# EAGLE schematic PT08M (EAGLE 6.6.0)

## Sheet 1 of 3
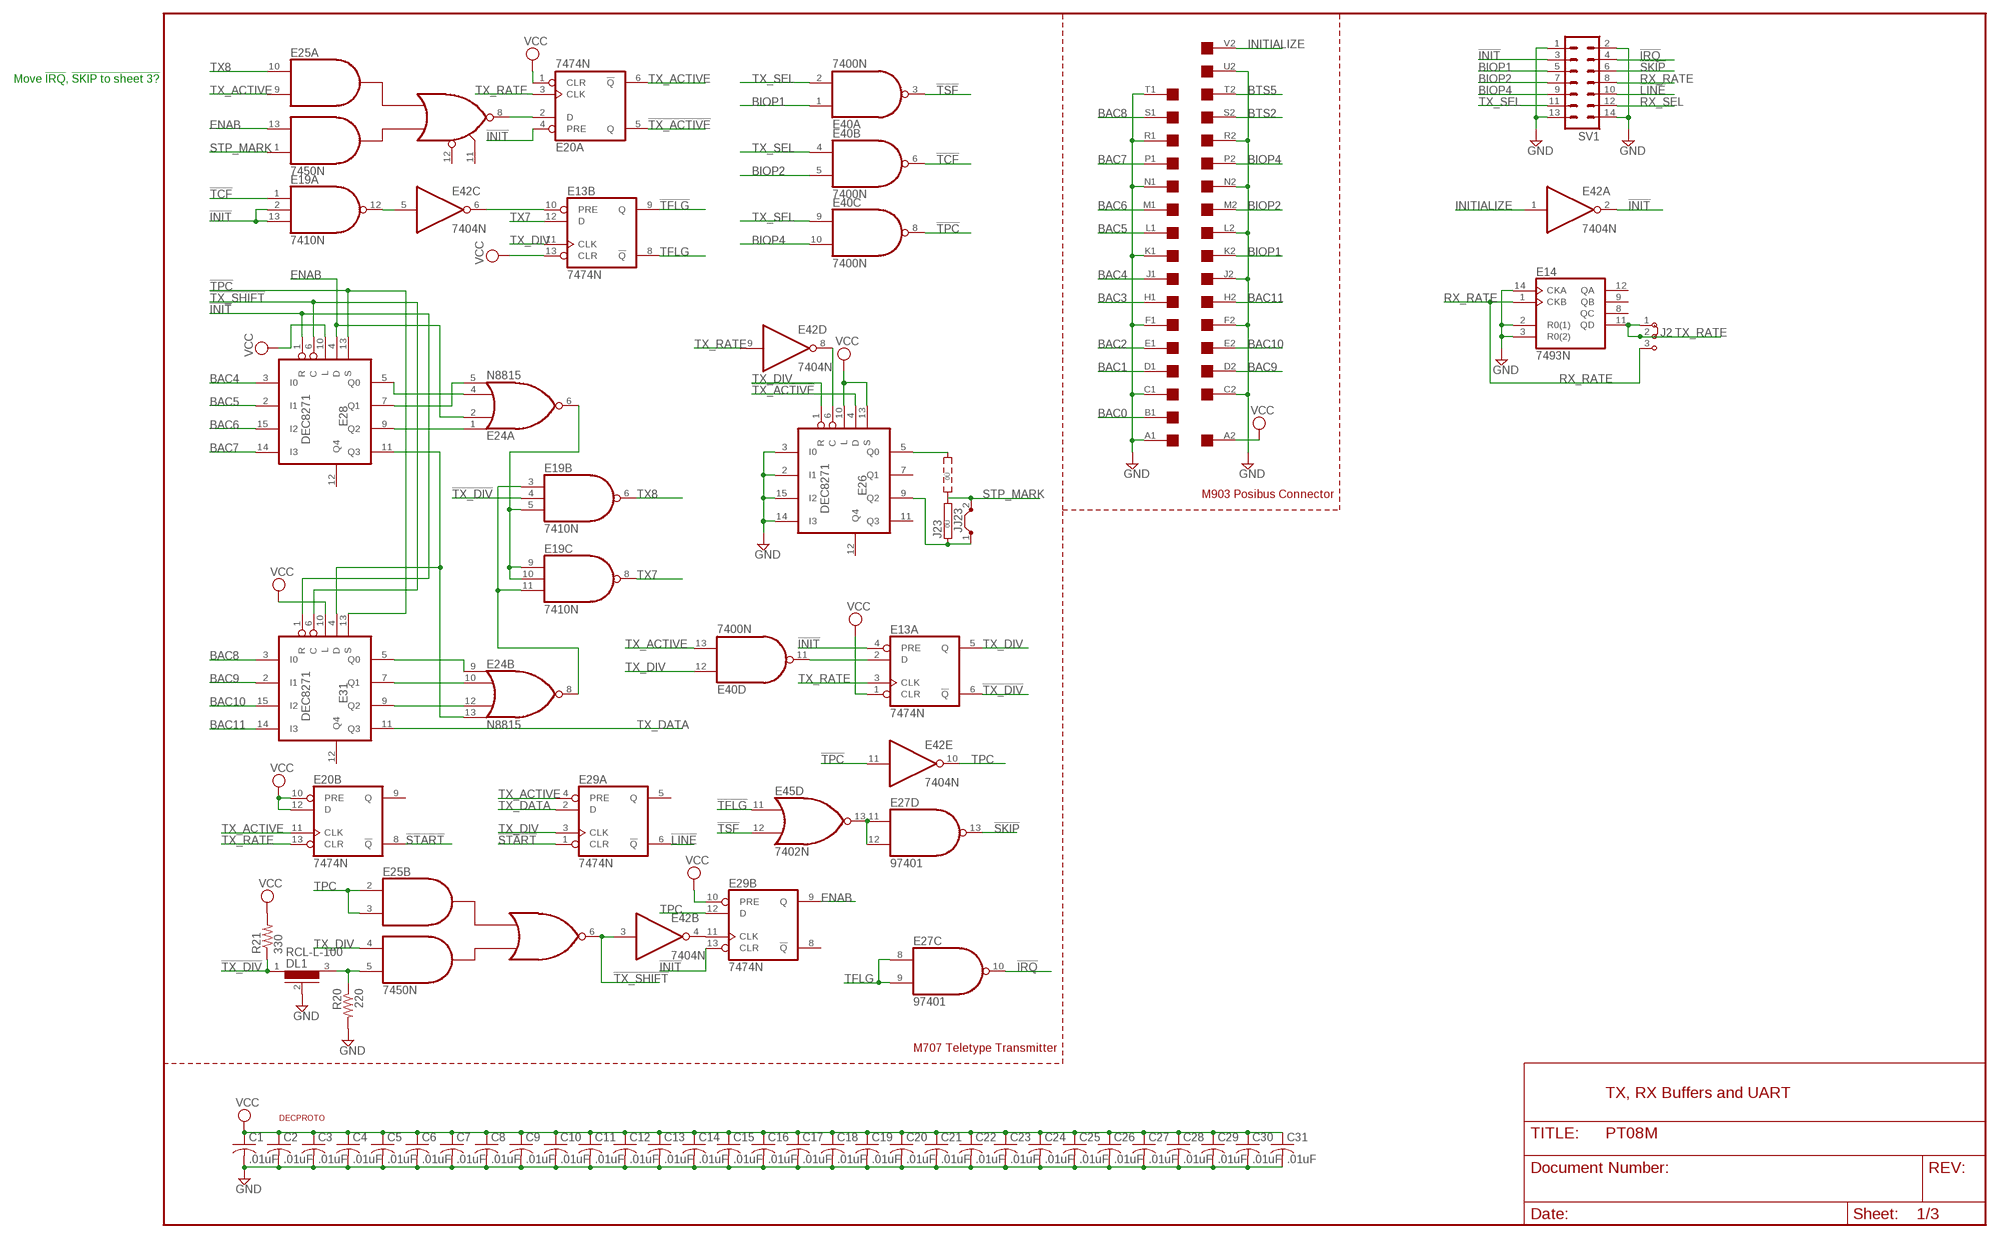
[diagram p0: schematic, sheet 1]

### Parts
C1  .01uF  C-US050-025X075  [C050-025X075]
C2  .01uF  C-US050-025X075  [C050-025X075]
C3  .01uF  C-US050-025X075  [C050-025X075]
C4  .01uF  C-US050-025X075  [C050-025X075]
C5  .01uF  C-US050-025X075  [C050-025X075]
C6  .01uF  C-US050-025X075  [C050-025X075]
C7  .01uF  C-US050-025X075  [C050-025X075]
C8  .01uF  C-US050-025X075  [C050-025X075]
C9  .01uF  C-US050-025X075  [C050-025X075]
C10  .01uF  C-US050-025X075  [C050-025X075]
C11  .01uF  C-US050-025X075  [C050-025X075]
C12  .01uF  C-US050-025X075  [C050-025X075]
C13  .01uF  C-US050-025X075  [C050-025X075]
C14  .01uF  C-US050-025X075  [C050-025X075]
C15  .01uF  C-US050-025X075  [C050-025X075]
C16  .01uF  C-US050-025X075  [C050-025X075]
C17  .01uF  C-US050-025X075  [C050-025X075]
C18  .01uF  C-US050-025X075  [C050-025X075]
C19  .01uF  C-US050-025X075  [C050-025X075]
C20  .01uF  C-US050-025X075  [C050-025X075]
C21  .01uF  C-US050-025X075  [C050-025X075]
C22  .01uF  C-US050-025X075  [C050-025X075]
C23  .01uF  C-US050-025X075  [C050-025X075]
C24  .01uF  C-US050-025X075  [C050-025X075]
C25  .01uF  C-US050-025X075  [C050-025X075]
C26  .01uF  C-US050-025X075  [C050-025X075]
C27  .01uF  C-US050-025X075  [C050-025X075]
C28  .01uF  C-US050-025X075  [C050-025X075]
C29  .01uF  C-US050-025X075  [C050-025X075]
C30  .01uF  C-US050-025X075  [C050-025X075]
C31  .01uF  C-US050-025X075  [C050-025X075]
DL1  RCL-L-100  RCL-L-00-05  [RCL-L-00-05]
E13  7474N  74S74N  [DIL14]
E14  7493N  74LS93N  [DIL14]
E19  7410N  [DIL14]
E20  7474N  74S74N  [DIL14]
E24  N8815  [DIL14]
E25  7450N  [DIL14]
E26  DEC8271  [DIL16]
E27  97401  74LS01N  [DIL14]
E28  DEC8271  [DIL16]
E29  7474N  74S74N  [DIL14]
E31  DEC8271  [DIL16]
E40  7400N  [DIL14]
E42  7404N  [DIL14]
E45  7402N  [DIL14]
J2  J2X2MM  [04C]
J23  0R2  [0R2/10]
JJ23  J10MM  [10]
N14  EDGE-2CONNECTOR  [EDGE-CON2]
R20  220  R-US_0207/10  [0207/10]
R21  330  R-US_0207/10  [0207/10]
SV1  ML14L  [ML14L]
U$2  DECPROTO  [DECPROTO111]

### Nets
!INIT: E13.4(A:PRE) E19.2(A:I1) E19.13(A:I2) E20.4(A:PRE) E28.1(R) E29.13(B:CLR) E31.1(R) E42.2(A:O) SV1.3 ; also sheet 2,3
!IRQ: E27.10(C:O) SV1.4 ; also sheet 2,3
!LINE: E29.6(A:!Q) SV1.10 ; also sheet 2,3
!SKIP: E27.13(D:O) SV1.6 ; also sheet 2,3
!START: E20.8(B:!Q) E29.1(A:CLR)
!TCF: E19.1(A:I0) E40.6(B:O)
!TFLG: E13.9(B:Q) E45.11(D:I0)
!TPC: E28.13(S) E31.13(S) E40.8(C:O) E42.11(E:I)
!TSF: E40.3(A:O) E45.12(D:I1)
!TX_ACTIVE: E20.5(A:Q) E26.4(D)
!TX_DIV: DL1.1 E13.6(A:!Q) E19.4(B:I1) R21.1
!TX_SHIFT: E25.6(B:O) E28.6(C) E31.6(C) E42.3(B:I)
BAC0: N14.B1
BAC1: N14.D1
BAC2: N14.E1
BAC3: N14.H1
BAC4: E28.3(I0) N14.J1
BAC5: E28.2(I1) N14.L1
BAC6: E28.15(I2) N14.M1
BAC7: E28.14(I3) N14.P1
BAC8: E31.3(I0) N14.S1
BAC9: E31.2(I1) N14.D2
BAC10: E31.15(I2) N14.E2
BAC11: E31.14(I3) N14.H2
BIOP1: E40.1(A:I0) N14.K2 SV1.5 ; also sheet 2,3
BIOP2: E40.5(B:I1) N14.M2 SV1.7 ; also sheet 2,3
BIOP4: E40.10(C:I1) N14.P2 SV1.9 ; also sheet 2,3
BTS2: N14.S2
BTS5: N14.T2
ENAB: E24.2(A:I1) E25.13(A:I3) E28.4(D) E29.9(B:Q)
GND [Supply]: C1.2 C2.2 C3.2 C4.2 C5.2 C6.2 C7.2 C8.2 C9.2 C10.2 C11.2 C12.2 C13.2 C14.2 C15.2 C16.2 C17.2 C18.2 C19.2 C20.2 C21.2 C22.2 C23.2 C24.2 C25.2 C26.2 C27.2 C28.2 C29.2 C30.2 C31.2 DL1.2 E14.2(R0(1)) E14.3(R0(2)) E14.14(CKA) E26.2(I1) E26.3(I0) E26.14(I3) E26.15(I2) N14.A1 N14.C1 N14.C2 N14.F1 N14.F2 N14.J2 N14.K1 N14.L2 N14.N1 N14.N2 N14.R1 N14.R2 N14.T1 N14.U2 R20.2 SV1.1 SV1.2 SV1.13 SV1.14 ; also sheet 2,3
INITIALIZE: E42.1(A:I) N14.V2
N$16: E19.12(A:O) E42.5(C:I)
N$17: E13.10(B:PRE) E42.6(C:O)
N$56: E24.1(A:I0) E28.9(Q2)
N$60: E24.4(A:I2) E28.5(Q0)
N$61: E24.13(B:I3) E28.11(Q3) E31.4(D)
N$62: E24.5(A:I3) E28.7(Q1)
N$63: E24.9(B:I0) E31.5(Q0)
N$65: E24.10(B:I1) E31.7(Q1)
N$66: E24.12(B:I2) E31.9(Q2)
N$68: E19.3(B:I0) E19.11(C:I2) E24.8(B:O)
N$69: E19.5(B:I2) E19.9(C:I0) E19.10(C:I1) E24.6(A:O)
N$94: E13.2(A:D) E40.11(D:O)
N$102: E29.11(B:CLK) E42.4(B:O)
N$103: DL1.3 E25.5(B:I4) R20.1
N$108: E20.2(A:D) E25.8(A:O)
N$119: E26.9(Q2) J23.1 JJ23.1
N$145: E26.6(C) E42.8(D:O)
N$146: E26.5(Q0) J23.3
RX_RATE: E14.1(CKB) J2.3 SV1.8 ; also sheet 2,3
RX_SEL: SV1.12 ; also sheet 2,3
STP_MARK: E25.1(A:I4) J23.2 JJ23.2
TFLG: E13.8(B:!Q) E27.8(C:I0) E27.9(C:I1)
TPC: E25.2(B:I1) E25.3(B:I2) E29.12(B:D) E42.10(E:O)
TSKP: E27.11(D:I0) E27.12(D:I1) E45.13(D:O)
TX7: E13.12(B:D) E19.8(C:O)
TX8: E19.6(B:O) E25.10(A:I1)
TX_ACTIVE: E20.6(A:!Q) E20.11(B:CLK) E25.9(A:I2) E29.4(A:PRE) E40.13(D:I1)
TX_DATA: E29.2(A:D) E31.11(Q3)
TX_DIV: E13.5(A:Q) E13.11(B:CLK) E25.4(B:I3) E26.1(R) E29.3(A:CLK) E40.12(D:I0)
TX_RATE: E13.3(A:CLK) E14.11(QD) E20.3(A:CLK) E20.13(B:CLR) E42.9(D:I) J2.1 J2.2
TX_SEL: E40.2(A:I1) E40.4(B:I0) E40.9(C:I0) SV1.11 ; also sheet 2,3
VCC [Supply]: C1.1 C2.1 C3.1 C4.1 C5.1 C6.1 C7.1 C8.1 C9.1 C10.1 C11.1 C12.1 C13.1 C14.1 C15.1 C16.1 C17.1 C18.1 C19.1 C20.1 C21.1 C22.1 C23.1 C24.1 C25.1 C26.1 C27.1 C28.1 C29.1 C30.1 C31.1 E13.1(A:CLR) E13.13(B:CLR) E20.1(A:CLR) E20.10(B:PRE) E20.12(B:D) E26.10(L) E26.13(S) E28.10(L) E29.10(B:PRE) E31.10(L) N14.A2 R21.2 ; also sheet 2,3
Unconnected: E14.8(QC) E14.9(QB) E14.12(QA) E20.9(B:Q) E25.11(A:I6) E25.12(A:I5) E26.7(Q1) E26.11(Q3) E26.12(Q4) E28.12(Q4) E29.5(A:Q) E29.8(B:!Q) E31.12(Q4) E42.12(F:O) E42.13(F:I) E45.1(A:O) E45.2(A:I0) E45.3(A:I1) E45.4(B:O) E45.5(B:I0) E45.6(B:I1) E45.8(C:I0) E45.9(C:I1) E45.10(C:O) N14.B2 N14.U1 N14.V1

### Notes on the sheet
- Move !IRQ, !SKIP to sheet 3?
- M903 Posibus Connector
- M707 Teletype Transmitter
- TX, RX Buffers and UART

## Sheet 2 of 3
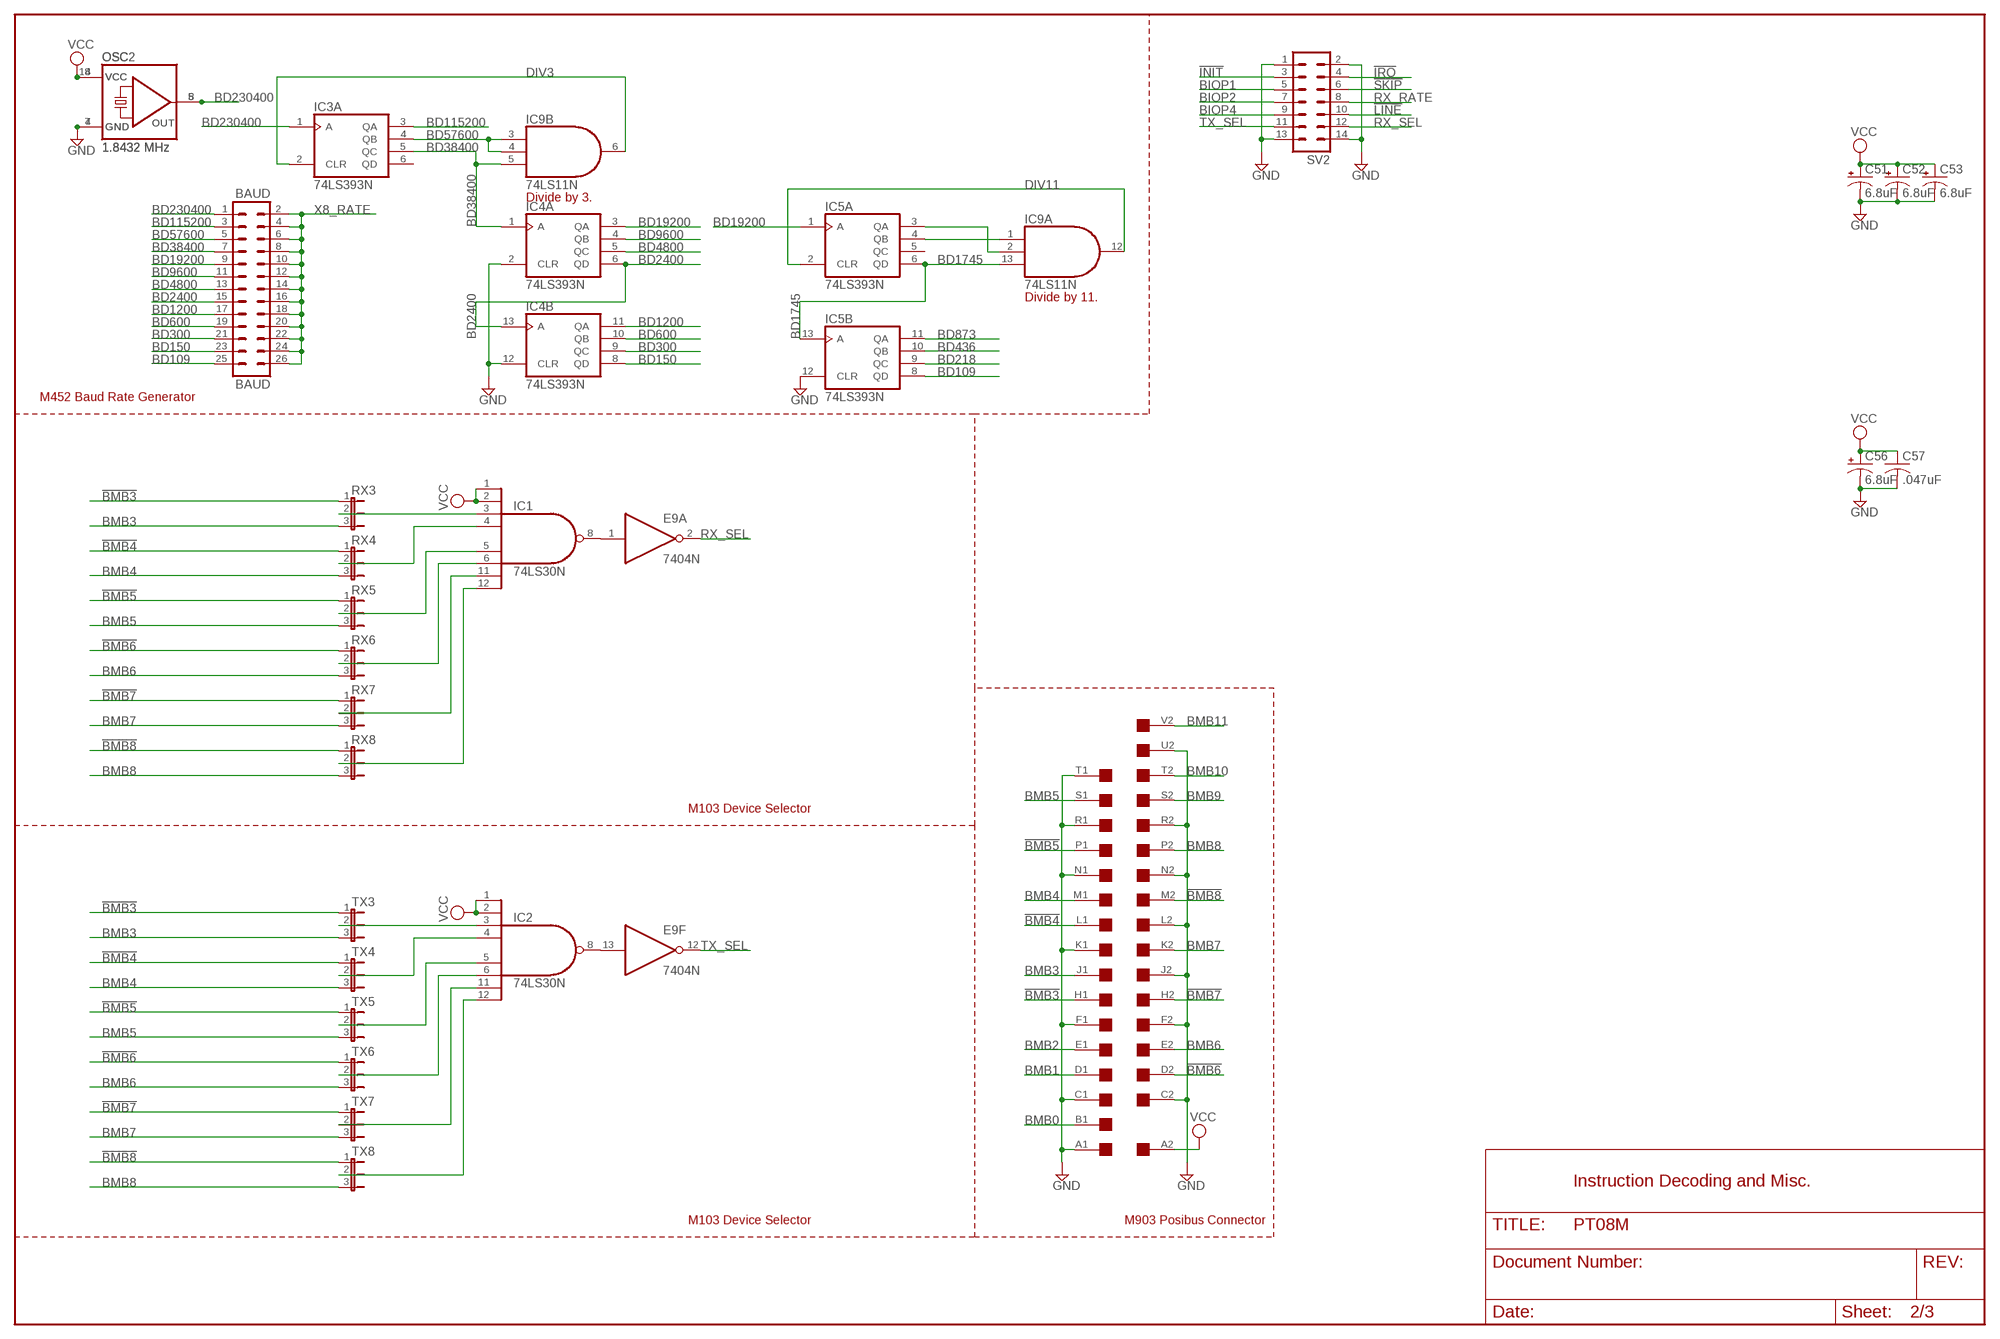
[diagram p1: schematic, sheet 2]

### Parts
BAUD  BAUD  MA13-2  [MA13-2]
C51  6.8uF  CPOL-USE20-8AXIAL  [E12-8]
C52  6.8uF  CPOL-USE20-8AXIAL  [E12-8]
C53  6.8uF  CPOL-USE20-8AXIAL  [E12-8]
C56  6.8uF  CPOL-USE20-8AXIAL  [E12-8]
C57  .047uF  C-US050-025X075  [C050-025X075]
E9  7404N  [DIL14]
IC1  74LS30N  [DIL14]
IC2  74LS30N  [DIL14]
IC3  74LS393N  [DIL14]
IC4  74LS393N  [DIL14]
IC5  74LS393N  [DIL14]
IC9  74LS11N  [DIL14]
N15  EDGE-2CONNECTOR  [EDGE-CON2]
OSC  1.8432 MHz  QG5460  [DIL08S]
OSC2  1.8432 MHz  QG5860  [DIL14S]
RX3  JP2E  [JP2]
RX4  JP2E  [JP2]
RX5  JP2E  [JP2]
RX6  JP2E  [JP2]
RX7  JP2E  [JP2]
RX8  JP2E  [JP2]
SV2  ML14L  [ML14L]
TX3  JP2E  [JP2]
TX4  JP2E  [JP2]
TX5  JP2E  [JP2]
TX6  JP2E  [JP2]
TX7  JP2E  [JP2]
TX8  JP2E  [JP2]

### Nets
!BMB3: N15.H1 RX3.1 TX3.1
!BMB4: N15.L1 RX4.1 TX4.1
!BMB5: N15.P1 RX5.1 TX5.1
!BMB6: N15.D2 RX6.1 TX6.1
!BMB7: N15.H2 RX7.1 TX7.1
!BMB8: N15.M2 RX8.1 TX8.1
!INIT: SV2.3 ; also sheet 1,3
!IRQ: SV2.4 ; also sheet 1,3
!LINE: SV2.10 ; also sheet 1,3
!RX_SEL: E9.1(A:I) IC1.8(O)
!SKIP: SV2.6 ; also sheet 1,3
!TX_SEL: E9.13(F:I) IC2.8(O)
BD109: BAUD.25 IC5.8(B:QD)
BD150: BAUD.23 IC4.8(B:QD)
BD218: IC5.9(B:QC)
BD300: BAUD.21 IC4.9(B:QC)
BD436: IC5.10(B:QB)
BD600: BAUD.19 IC4.10(B:QB)
BD873: IC5.11(B:QA)
BD1200: BAUD.17 IC4.11(B:QA)
BD1745: IC5.6(A:QD) IC5.13(B:A) IC9.13(A:I2)
BD2400: BAUD.15 IC4.6(A:QD) IC4.13(B:A)
BD4800: BAUD.13 IC4.5(A:QC)
BD9600: BAUD.11 IC4.4(A:QB)
BD19200: BAUD.9 IC4.3(A:QA) IC5.1(A:A)
BD38400: BAUD.7 IC3.5(A:QC) IC4.1(A:A) IC9.5(B:I2)
BD57600: BAUD.5 IC3.4(A:QB) IC9.3(B:I0) IC9.4(B:I1)
BD115200: BAUD.3 IC3.3(A:QA)
BD230400: BAUD.1 IC3.1(A:A) OSC2.8(OUT) OSC.5(OUT)
BIOP1: SV2.5 ; also sheet 1,3
BIOP2: SV2.7 ; also sheet 1,3
BIOP4: SV2.9 ; also sheet 1,3
BMB0: N15.B1
BMB1: N15.D1
BMB2: N15.E1
BMB3: N15.J1 RX3.3 TX3.3
BMB4: N15.M1 RX4.3 TX4.3
BMB5: N15.S1 RX5.3 TX5.3
BMB6: N15.E2 RX6.3 TX6.3
BMB7: N15.K2 RX7.3 TX7.3
BMB8: N15.P2 RX8.3 TX8.3
BMB9: N15.S2
BMB10: N15.T2
BMB11: N15.V2
DIV3 [Supply]: IC3.2(A:CLR) IC9.6(B:O)
DIV11: IC5.2(A:CLR) IC9.12(A:O)
GND [Supply]: C51.- C52.- C53.- C56.- C57.2 IC4.2(A:CLR) IC4.12(B:CLR) IC5.12(B:CLR) N15.A1 N15.C1 N15.C2 N15.F1 N15.F2 N15.J2 N15.K1 N15.L2 N15.N1 N15.N2 N15.R1 N15.R2 N15.T1 N15.U2 OSC2.7(GND) OSC.4(GND) SV2.1 SV2.2 SV2.13 SV2.14 ; also sheet 1,3
N$1: IC2.4(I3) TX4.2
N$2: IC1.3(I2) RX3.2
N$3: IC1.4(I3) RX4.2
N$5: IC2.6(I5) TX6.2
N$6: IC1.5(I4) RX5.2
N$7: IC2.5(I4) TX5.2
N$8: IC2.12(I7) TX8.2
N$9: IC2.11(I6) TX7.2
N$10: IC5.3(A:QA) IC9.2(A:I1)
N$11: IC2.3(I2) TX3.2
N$24: IC1.12(I7) RX8.2
N$25: IC5.4(A:QB) IC9.1(A:I0)
N$30: IC1.11(I6) RX7.2
N$86: IC1.6(I5) RX6.2
RX_RATE: SV2.8 ; also sheet 1,3
RX_SEL: E9.2(A:O) SV2.12 ; also sheet 1,3
TX_SEL: E9.12(F:O) SV2.11 ; also sheet 1,3
VCC [Supply]: C51.+ C52.+ C53.+ C56.+ C57.1 IC1.1(I0) IC1.2(I1) IC2.1(I0) IC2.2(I1) N15.A2 OSC2.14(VCC) OSC.8(VCC) ; also sheet 1,3
X8_RATE: BAUD.2 BAUD.4 BAUD.6 BAUD.8 BAUD.10 BAUD.12 BAUD.14 BAUD.16 BAUD.18 BAUD.20 BAUD.22 BAUD.24 BAUD.26
Unconnected: IC3.6(A:QD) IC3.8(B:QD) IC3.9(B:QC) IC3.10(B:QB) IC3.11(B:QA) IC3.12(B:CLR) IC3.13(B:A) IC5.5(A:QC) IC9.8(C:O) IC9.9(C:I0) IC9.10(C:I1) IC9.11(C:I2) N15.B2 N15.U1 N15.V1

### Notes on the sheet
- Divide by 3.
- Divide by 11.
- M452 Baud Rate Generator
- M103 Device Selector
- Instruction Decoding and Misc.
- M103 Device Selector | M903 Posibus Connector

## Sheet 3 of 3
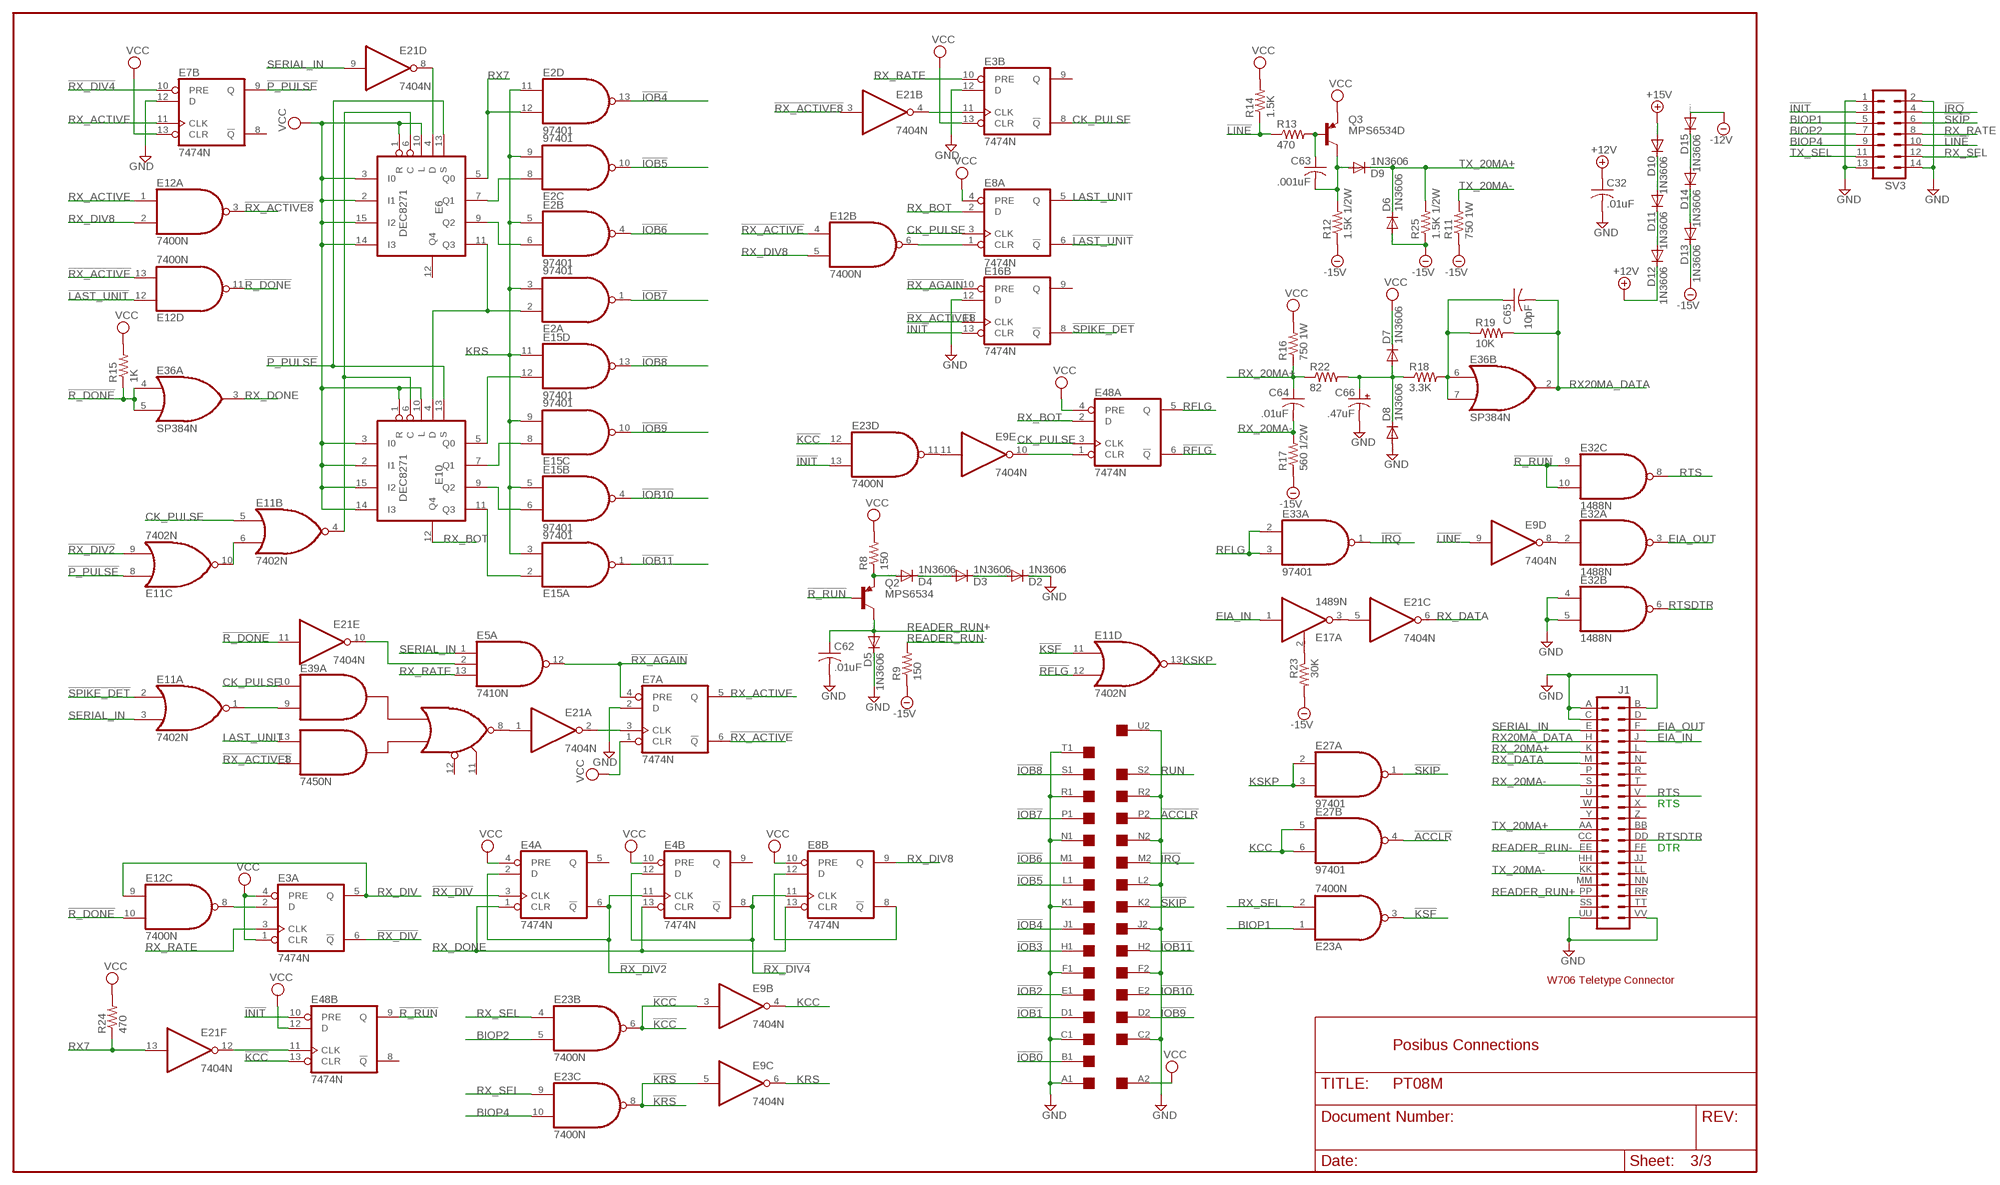
[diagram p2: schematic, sheet 3]

### Parts
C32  .01uF  C-US050-025X075  [C050-025X075]
C62  .01uF  C-US050-025X075  [C050-025X075]
C63  .001uF  C-US050-025X075  [C050-025X075]
C64  .01uF  C-US050-025X075  [C050-025X075]
C65  10pF  C-US050-025X075  [C050-025X075]
C66  .47uF  CPOL-USE15-5AXIAL  [E15-5]
D2  1N3606  DIODE-DO35-10  [DO35-10]
D3  1N3606  DIODE-DO35-10  [DO35-10]
D4  1N3606  DIODE-DO35-10  [DO35-10]
D5  1N3606  DIODE-DO35-10  [DO35-10]
D6  1N3606  DIODE-DO35-10  [DO35-10]
D7  1N3606  DIODE-DO35-10  [DO35-10]
D8  1N3606  DIODE-DO35-10  [DO35-10]
D9  1N3606  DIODE-DO35-10  [DO35-10]
D10  1N3606  DIODE-DO35-10  [DO35-10]
D11  1N3606  DIODE-DO35-10  [DO35-10]
D12  1N3606  DIODE-DO35-10  [DO35-10]
D13  1N3606  DIODE-DO35-10  [DO35-10]
D14  1N3606  DIODE-DO35-10  [DO35-10]
D15  1N3606  DIODE-DO35-10  [DO35-10]
E2  97401  74LS01N  [DIL14]
E3  7474N  74S74N  [DIL14]
E4  7474N  74S74N  [DIL14]
E5  7410N  [DIL14]
E6  DEC8271  [DIL16]
E7  7474N  74S74N  [DIL14]
E8  7474N  74S74N  [DIL14]
E10  DEC8271  [DIL16]
E11  7402N  [DIL14]
E12  7400N  [DIL14]
E15  97401  74LS01N  [DIL14]
E16  7474N  74S74N  [DIL14]
E17  1489N  [DIL14]
E21  7404N  [DIL14]
E23  7400N  [DIL14]
E32  1488N  [DIL14]
E33  97401  74LS01N  [DIL14]
E36  SP384N  [DIL14]
E39  7450N  [DIL14]
E48  7474N  74S74N  [DIL14]
J1  DEC40PINH  [DEC40PINH]
N16  EDGE-2CONNECTOR  [EDGE-CON2]
Q2  MPS6534  -PNP-TO5  [TO5]
Q3  MPS6534D  -PNP-TO5  [TO5]
R8  150  R-US_0207/10  [0207/10]
R9  150  R-US_0207/10  [0207/10]
R11  750 1W  R-US_0617/17  [0617/17]
R12  1.5K 1/2W  R-US_0411/15  [0411/15]
R13  470  R-US_0207/10  [0207/10]
R14  1.5K  R-US_0207/10  [0207/10]
R15  1K  R-US_0207/10  [0207/10]
R16  750 1W  R-US_0617/17  [0617/17]
R17  560 1/2W  R-US_0411/15  [0411/15]
R18  3.3K  R-US_0207/10  [0207/10]
R19  10K  R-US_0207/10  [0207/10]
R22  82  R-US_0207/10  [0207/10]
R23  30K  R-US_0207/10  [0207/10]
R24  470  R-US_0207/10  [0207/10]
R25  1.5K 1/2W  R-US_0411/15  [0411/15]
SV3  ML14L  [ML14L]

### Nets
!ACCLR: E27.4(B:O) N16.P2
!INIT: E16.13(B:CLR) E23.13(D:I1) E48.10(B:PRE) SV3.3 ; also sheet 1,2
!IOB0: N16.B1
!IOB1: N16.D1
!IOB2: N16.E1
!IOB3: N16.H1
!IOB4: E2.13(D:O) N16.J1
!IOB5: E2.10(C:O) N16.L1
!IOB6: E2.4(B:O) N16.M1
!IOB7: E2.1(A:O) N16.P1
!IOB8: E15.13(D:O) N16.S1
!IOB9: E15.10(C:O) N16.D2
!IOB10: E15.4(B:O) N16.E2
!IOB11: E15.1(A:O) N16.H2
!IRQ: E33.1(A:O) N16.M2 SV3.4 ; also sheet 1,2
!KCC: E9.3(B:I) E23.6(B:O) E23.12(D:I0) E48.13(B:CLR)
!KRS: E9.5(C:I) E23.8(C:O)
!KSF: E11.11(D:I0) E23.3(A:O)
!LAST_UNIT: E8.6(A:!Q) E12.12(D:I0)
!LINE: E9.9(D:I) R13.1 R14.1 SV3.10 ; also sheet 1,2
!P_PULSE: E6.13(S) E7.9(B:Q) E10.13(S) E11.8(C:I0)
!R_DONE: E12.10(C:I1) E12.11(D:O) E21.11(E:I) E36.4(A:I0) E36.5(A:I1) R15.1
!R_RUN: E32.9(C:I0) E32.10(C:I1) E48.9(B:Q) Q2.2(B)
!RFLG: E11.12(D:I1) E48.6(A:!Q)
!RX_ACTIVE: E7.6(A:!Q) E12.4(B:I0) E12.13(D:I1)
!RX_ACTIVE8: E12.3(A:O) E16.11(B:CLK) E21.3(B:I) E39.1(A:I4)
!RX_AGAIN: E5.12(A:O) E7.4(A:PRE) E16.10(B:PRE)
!RX_DIV: E3.6(A:!Q) E4.3(A:CLK)
!RX_DIV2: E4.2(A:D) E4.6(A:!Q) E4.11(B:CLK) E11.9(C:I1)
!RX_DIV4: E4.8(B:!Q) E4.12(B:D) E7.10(B:PRE) E8.11(B:CLK)
!SKIP: E27.1(A:O) N16.K2 SV3.6 ; also sheet 1,2
!SPIKE_DET: E11.2(A:I0) E16.8(B:!Q)
+12V [Supply]: C32.1 D12.C
+15V: D10.A
-12V [Supply]: D15.A
-15V [Supply]: D6.A D13.C R9.1 R11.1 R12.1 R17.1 R23.2 R25.1
BIOP1: E23.1(A:I0) SV3.5 ; also sheet 1,2
BIOP2: E23.5(B:I1) SV3.7 ; also sheet 1,2
BIOP4: E23.10(C:I1) SV3.9 ; also sheet 1,2
CK_PULSE: E3.8(B:!Q) E8.3(A:CLK) E11.5(B:I0) E39.10(A:I1) E48.3(A:CLK)
EIA_IN: E17.1(A:I) J1.J
EIA_OUT [Supply]: E32.3(A:O) J1.F
GND [Supply]: C32.2 C62.2 C66.- D2.C D5.C D8.A E3.12(B:D) E7.2(A:D) E7.12(B:D) E16.12(B:D) E32.4(B:I0) E32.5(B:I1) J1.A J1.B J1.C J1.UU J1.VV N16.A1 N16.C1 N16.C2 N16.F1 N16.F2 N16.J2 N16.K1 N16.L2 N16.N1 N16.N2 N16.R1 N16.R2 N16.T1 N16.U2 SV3.1 SV3.2 SV3.13 SV3.14 ; also sheet 1,2
KCC: E9.4(B:O) E27.5(B:I0) E27.6(B:I1)
KRS: E2.3(A:I1) E2.5(B:I0) E2.9(C:I1) E2.11(D:I0) E9.6(C:O) E15.3(A:I1) E15.5(B:I0) E15.9(C:I1) E15.11(D:I0)
KSKP: E11.13(D:O) E27.2(A:I0) E27.3(A:I1)
LAST_UNIT: E8.5(A:Q) E39.13(A:I3)
N$4: E9.8(D:O) E32.2(A:I)
N$26: E21.12(F:O) E48.11(B:CLK)
N$28: E9.10(E:O) E48.1(A:CLR)
N$29: E9.11(E:I) E23.11(D:O)
N$31: D2.A D3.C
N$34: E2.8(C:I0) E6.7(Q1)
N$35: E2.2(A:I0) E6.11(Q3) E10.4(D)
N$36: E2.6(B:I1) E6.9(Q2)
N$37: E10.5(Q0) E15.12(D:I1)
N$38: E10.7(Q1) E15.8(C:I0)
N$39: E10.9(Q2) E15.6(B:I1)
N$40: E10.11(Q3) E15.2(A:I0)
N$41: E6.6(C) E10.6(C) E11.4(B:O)
N$42: E11.6(B:I1) E11.10(C:O)
N$44: E6.4(D) E21.8(D:O)
N$67: E7.3(A:CLK) E21.2(A:O)
N$70: E21.1(A:I) E39.8(A:O)
N$73: C63.2 D9.A Q3.3(C) R12.2
N$76: E3.2(A:D) E12.8(C:O)
N$77: E17.2(A:RC) R23.1
N$78: E5.2(A:I1) E21.10(E:O)
N$79 [Supply]: D13.A D14.C
N$81: E11.1(A:O) E39.9(A:I2)
N$82: E3.11(B:CLK) E21.4(B:O)
N$83: E17.3(A:O) E21.5(C:I)
N$87: E8.8(B:!Q) E8.12(B:D)
N$91: E8.1(A:CLR) E12.6(B:O)
N$120: D4.A Q2.1(E) R8.1
N$121: D3.A D4.C
N$122 [Supply]: D14.A D15.C
N$123: C66.+ D7.A D8.C R18.1 R22.2
N$125 [Supply]: D10.C D11.A
N$127 [Supply]: D11.C D12.A
N$128: C65.1 E36.6(B:I0) E36.7(B:I1) R18.2 R19.1
N$129: C63.1 Q3.2(B) R13.2
READER_RUN+ [Supply]: C62.1 D5.A J1.PP Q2.3(C)
READER_RUN- [Supply]: J1.EE R9.2
RFLG: E33.2(A:I0) E33.3(A:I1) E48.5(A:Q)
RTS: E32.8(C:O) J1.V
RTSDTR [Supply]: E32.6(B:O) J1.DD
RUN: N16.S2
RX7: E2.12(D:I1) E6.5(Q0) E21.13(F:I) R24.1
RX20MA_DATA: C65.2 E36.2(B:O) J1.H R19.2
RX_20MA+ [Supply]: C64.1 J1.K R16.1 R22.1
RX_20MA- [Supply]: C64.2 J1.S R17.2
RX_ACTIVE: E7.5(A:Q) E7.11(B:CLK) E12.1(A:I0)
RX_BOT: E8.2(A:D) E10.12(Q4) E48.2(A:D)
RX_DATA: E21.6(C:O) J1.M
RX_DIV: E3.5(A:Q) E12.9(C:I0)
RX_DIV8: E8.9(B:Q) E12.2(A:I1) E12.5(B:I1)
RX_DONE: E4.1(A:CLR) E4.13(B:CLR) E8.13(B:CLR) E36.3(A:O)
RX_RATE: E3.3(A:CLK) E3.10(B:PRE) E5.13(A:I2) SV3.8 ; also sheet 1,2
RX_SEL: E23.2(A:I1) E23.4(B:I0) E23.9(C:I0) SV3.12 ; also sheet 1,2
SERIAL_IN: E5.1(A:I0) E11.3(A:I1) E21.9(D:I) J1.E
TX_20MA+ [Supply]: D6.C D9.C J1.AA R25.2
TX_20MA- [Supply]: J1.KK R11.2
TX_SEL: SV3.11 ; also sheet 1,2
VCC [Supply]: D7.C E3.1(A:CLR) E3.4(A:PRE) E3.13(B:CLR) E4.4(A:PRE) E4.10(B:PRE) E6.1(R) E6.2(I1) E6.3(I0) E6.10(L) E6.14(I3) E6.15(I2) E7.1(A:CLR) E7.13(B:CLR) E8.4(A:PRE) E8.10(B:PRE) E10.1(R) E10.2(I1) E10.3(I0) E10.10(L) E10.14(I3) E10.15(I2) E48.4(A:PRE) E48.12(B:D) N16.A2 Q3.1(E) R8.2 R14.2 R15.2 R16.2 R24.2 ; also sheet 1,2
Unconnected: E3.9(B:Q) E4.5(A:Q) E4.9(B:Q) E5.3(B:I0) E5.4(B:I1) E5.5(B:I2) E5.6(B:O) E5.8(C:O) E5.9(C:I0) E5.10(C:I1) E5.11(C:I2) E6.12(Q4) E7.8(B:!Q) E16.1(A:CLR) E16.2(A:D) E16.3(A:CLK) E16.4(A:PRE) E16.5(A:Q) E16.6(A:!Q) E16.9(B:Q) E17.4(B:I) E17.5(B:RC) E17.6(B:O) E17.8(C:O) E17.9(C:RC) E17.10(C:I) E17.11(D:O) E17.12(D:RC) E17.13(D:I) E32.11(D:O) E32.12(D:I0) E32.13(D:I1) E33.4(B:O) E33.5(B:I0) E33.6(B:I1) E33.8(C:I0) E33.9(C:I1) E33.10(C:O) E33.11(D:I0) E33.12(D:I1) E33.13(D:O) E36.9(C:I0) E36.10(C:I1) E36.11(D:I0) E36.12(D:I1) E36.13(D:O) E36.14(C:O) E39.2(B:I1) E39.3(B:I2) E39.4(B:I3) E39.5(B:I4) E39.6(B:O) E39.11(A:I6) E39.12(A:I5) E48.8(B:!Q) J1.BB J1.CC J1.D J1.FF J1.HH J1.JJ J1.L J1.LL J1.MM J1.N J1.NN J1.P J1.R J1.RR J1.SS J1.T J1.TT J1.U J1.W J1.X J1.Y J1.Z N16.B2 N16.T2 N16.U1 N16.V1 N16.V2

### Notes on the sheet
- RTS
- DTR
- W706 Teletype Connector
- Posibus Connections

## Power pins joined to a net without a drawn wire
+12V: E32.14(P:+12V)
-12V: E32.1(P:-12V)
GND: E2.7(P:GND) E3.7(P:GND) E4.7(P:GND) E5.7(P:GND) E6.8(GND) E7.7(P:GND) E8.7(P:GND) E9.7(P:GND) E10.8(GND) E11.7(P:GND) E12.7(P:GND) E13.7(P:GND) E14.10(GND) E15.7(P:GND) E16.7(P:GND) E17.7(P:GND) E19.7(P:GND) E20.7(P:GND) E21.7(P:GND) E23.7(P:GND) E24.7(P:GND) E25.7(P:GND) E26.8(GND) E27.7(P:GND) E28.8(GND) E29.7(P:GND) E31.8(GND) E32.7(P:GND) E33.7(P:GND) E36.1(GND) E39.7(P:GND) E40.7(P:GND) E42.7(P:GND) E45.7(P:GND) E48.7(P:GND) IC1.7(GND) IC2.7(GND) IC3.7(P:GND) IC4.7(P:GND) IC5.7(P:GND) IC9.7(P:GND)
VCC: E2.14(P:VCC) E3.14(P:VCC) E4.14(P:VCC) E5.14(P:VCC) E6.16(VCC) E7.14(P:VCC) E8.14(P:VCC) E9.14(P:VCC) E10.16(VCC) E11.14(P:VCC) E12.14(P:VCC) E13.14(P:VCC) E14.5(VCC) E15.14(P:VCC) E16.14(P:VCC) E17.14(P:VCC) E19.14(P:VCC) E20.14(P:VCC) E21.14(P:VCC) E23.14(P:VCC) E24.14(P:VCC) E25.14(P:VCC) E26.16(VCC) E27.14(P:VCC) E28.16(VCC) E29.14(P:VCC) E31.16(VCC) E33.14(P:VCC) E36.8(VCC) E39.14(P:VCC) E40.14(P:VCC) E42.14(P:VCC) E45.14(P:VCC) E48.14(P:VCC) IC1.14(VCC) IC2.14(VCC) IC3.14(P:VCC) IC4.14(P:VCC) IC5.14(P:VCC) IC9.14(P:VCC)

## Library data of the parts
BAUD = con-lstb:MA13-2: PIN HEADER; OC_FARNELL: unknown; OC_NEWARK: unknown
C1-C32 C57 C62-C65 = rcl:C-US: CAPACITOR, American symbol
C51-C53 C56 = dec-con:CPOL-USE20-8AXIAL: A 0.8 inch electrolytic.
C66 = rcl:CPOL-US: POLARIZED CAPACITOR, American symbol
D2-D15 = diode:DIODE-: DIODE
DL1 = dec-con:RCL-L-00-05: RCL-L Delay Line
E2 E15 E27 E33 = 74xx-us:74*01: Quad 2-input NAND gate, open collector
E3 E4 E7 E8 E13 E16 E20 E29 E48 = 74xx-us:74*74: Dual D type positive edge triggered FLIP FLOP, preset and clear
E5 E19 = 74xx-us:74*10: Triple 3-input NAND gate
E6 E10 E26 E28 E31 = dec-con:DEC8271: Parallel Load Shift Register
E9 E21 E42 = 74xx-us:74*04: Hex INVERTER
E11 E45 = 74xx-us:74*02: Quad 2-input NOR gate
E12 E23 E40 = 74xx-us:74*00: Quad 2-input NAND gate
E14 = 74xx-us:74*93: Decade, divide by twelve and binary COUNTER
E17 = dec-con:14*89: Quad line receivers BUFFER,
E24 = dec-con:N8815: Dual 4 Input NOR Gate
E25 E39 = dec-con:74*50: 4-2-3-2 input AND OR INVERTER gates
E32 = dec-con:14*88: Quad 2-input NAND gate
E36 = dec-con:SP384: Quad OR gate
IC1 IC2 = 74xx-us:74*30: 8-input NAND gate
IC3-IC5 = 74xx-us:74*393: Dual 4-bit decade and binary COUNTER
IC9 = 74xx-us:74*11: Triple 3-input AND gate
J1 = dec-con:DEC40PIN: PIN HEADER
J2 = jumper:J2: Jumper switch 2 x 2.5 mm
J23 = jumper:0R2: Bridge switch 0R 2 x 10mm
JJ23 = jumper:J: Bridge
N14-N16 = dec-con:EDGE-2: Double-Sided DEC edge connector.
OSC = crystal:QG5460: CRYSTAL RESONATOR; OC_FARNELL: unknown; OC_NEWARK: unknown
OSC2 = crystal:QG5860: CRYSTAL RESONATOR; OC_FARNELL: unknown; OC_NEWARK: unknown
Q2 Q3 = transistor:*-PNP-: PNP Transistror
R8 R9 R11-R25 = rcl:R-US_: RESISTOR, American symbol
RX3-RX8 TX3-TX8 = jumper:JP2E: JUMPER
SV1-SV3 = con-harting-ml:ML14: HARTING; OC_FARNELL: unknown; OC_NEWARK: unknown
U$2 = dec-con:DECPROTO: Various small DEC boards stuck together with break-away tab routing.

## Net classes
1 Supply: width 0.813 mm